# EAGLE schematic 555-v1 (EAGLE 9.5.1)
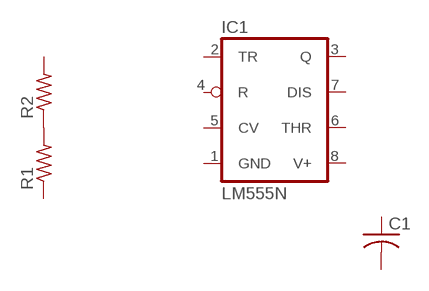
[diagram p0: schematic, sheet 1]

## Parts
C1  C-US050-030X075  [C050-030X075]
IC1  LM555N  [DIL08-ROUND]
R1  R-US_0207/9  [0207/9]
R2  R-US_0207/9  [0207/9]

## Nets
N$1: R1.2 R2.1
Unconnected: C1.1 C1.2 IC1.2(TR) IC1.3(Q) IC1.4(R) IC1.5(CV) IC1.6(THR) IC1.7(DIS) R1.1 R2.2

## Power pins joined to a net without a drawn wire
GND: IC1.1(GND)
V+: IC1.8(V+)

## Library data of the parts
C1 = adafruit:C-US: CAPACITOR, American symbol
IC1 = adafruit:*555: TIMER Changed DIP package to have round (not oval) pin pads http://www.ladyada.net/library/pcb/eaglelibrary.html
R1 R2 = adafruit:R-US_: RESISTOR, American symbol